# EAGLE design HackHarder (EAGLE 7.5.0)
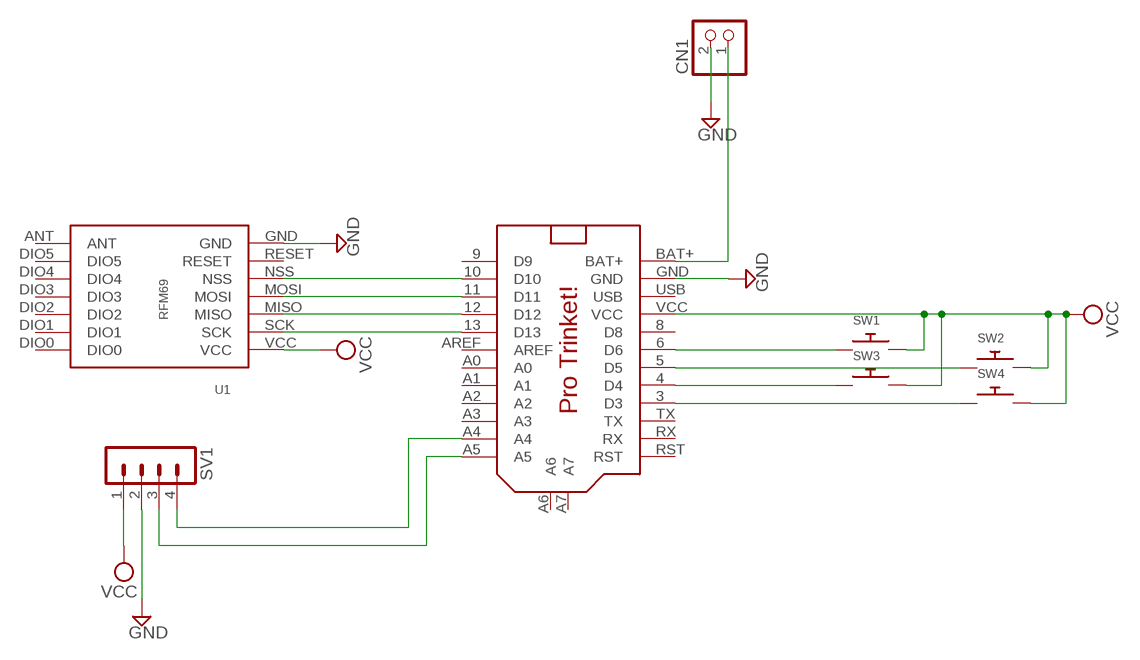
[diagram p0: schematic, sheet 1]

## Parts
CN1  JST_2PIN-SMT-RA  [JST-PH-2-SMT-RA]
MCU1  PRO_TRINKET  [PROTRINKET]
SV1  MA04-1  [MA04-1]
SW1  SWITCH_PUSHBUTTONEVQ-PE  [TACT_PANA-EVQ]
SW2  SWITCH_PUSHBUTTONEVQ-PE  [TACT_PANA-EVQ]
SW3  SWITCH_PUSHBUTTONEVQ-PE  [TACT_PANA-EVQ]
SW4  SWITCH_PUSHBUTTONEVQ-PE  [TACT_PANA-EVQ]
U1  RFM69HW  [RFM69_PADS]

## Nets
G$1: CN1.2 MCU1.GND SV1.2 U1.GND ; supply symbol labelled GND
N$2: CN1.1 MCU1.BAT+
N$3: MCU1.A5 SV1.3
N$4: MCU1.A4 SV1.4
N$5: MCU1.11(D11) U1.MOSI
N$6: MCU1.12(D12) U1.MISO
N$7: MCU1.13(D13) U1.SCK
N$8: MCU1.10(D10) U1.NSS
N$12: MCU1.6(D6) SW1.P$1
N$13: MCU1.5(D5) SW2.P$1
N$14: MCU1.4(D4) SW3.P$1
N$15: MCU1.3(D3) SW4.P$1
VCC: MCU1.VCC SV1.1 SW1.P$2 SW2.P$2 SW3.P$2 SW4.P$2 U1.VCC
Unconnected: MCU1.8(D8) MCU1.9(D9) MCU1.A0 MCU1.A1 MCU1.A2 MCU1.A3 MCU1.A6 MCU1.A7 MCU1.AREF MCU1.RST MCU1.RX MCU1.TX U1.ANT U1.DIO0 U1.DIO1 U1.DIO2 U1.DIO3 U1.DIO4 U1.DIO5 U1.RESET

## Power pins joined to a net without a drawn wire
USB: MCU1.USB

## Library data of the parts
CN1 = adafruit:JST_2PIN: JST 2-Pin Connectors of various flavors SMT-RA (S2B-PH-SM4) 4UConnector #17311 SMT (B2B-PH-SM4) THM-RA (S2B-PH) THM (B2B-PH)
MCU1 = adafruit:PRO_TRINKET
SV1 = con-lstb:MA04-1: PIN HEADER; OC_FARNELL: unknown; OC_NEWARK: unknown
SW1-SW4 = adafruit:SWITCH_PUSHBUTTON: Buttons SOFTTOUCHSMD_SJ - Soft touch temporary push button (Super Junk Akihabara) Compatible with SKPMANE010 [Mouser: 688-SKPMAN] C&K_KSS = Digikey: KSS221GLFS
U1 = HopeRF-RFMxx:RFM69HW

## Board
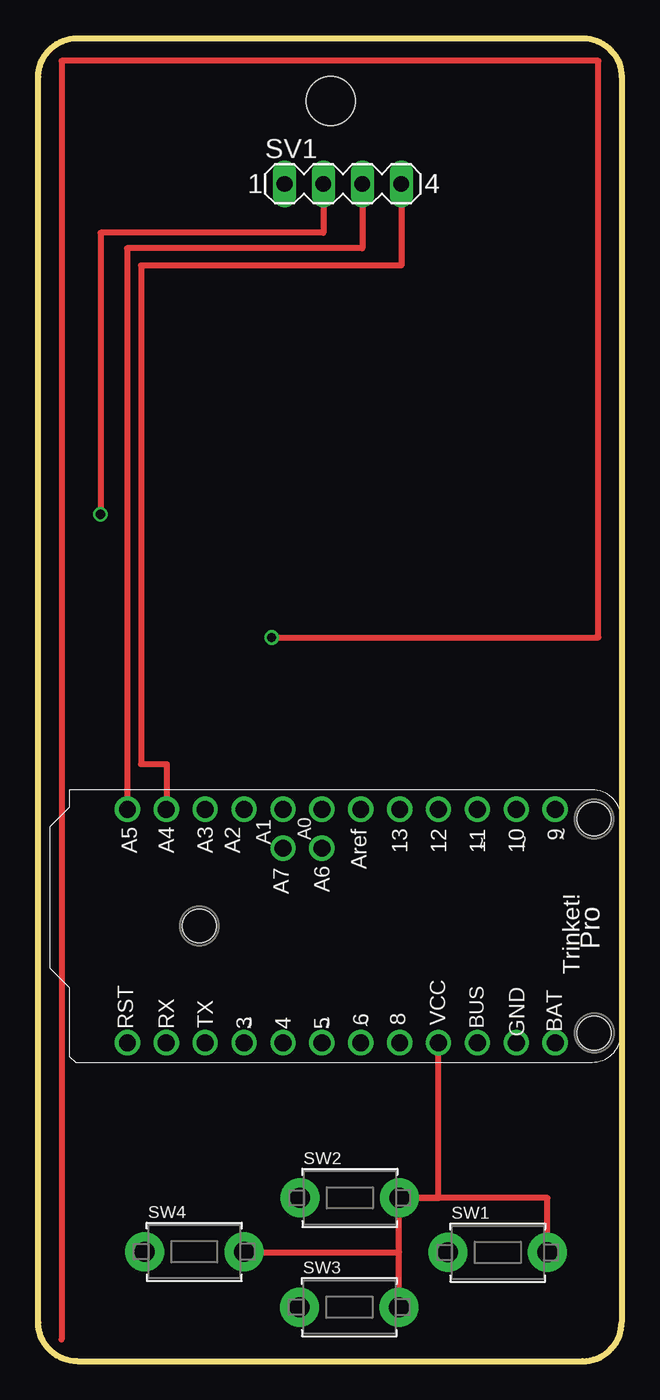
[diagram p1: board, top side]
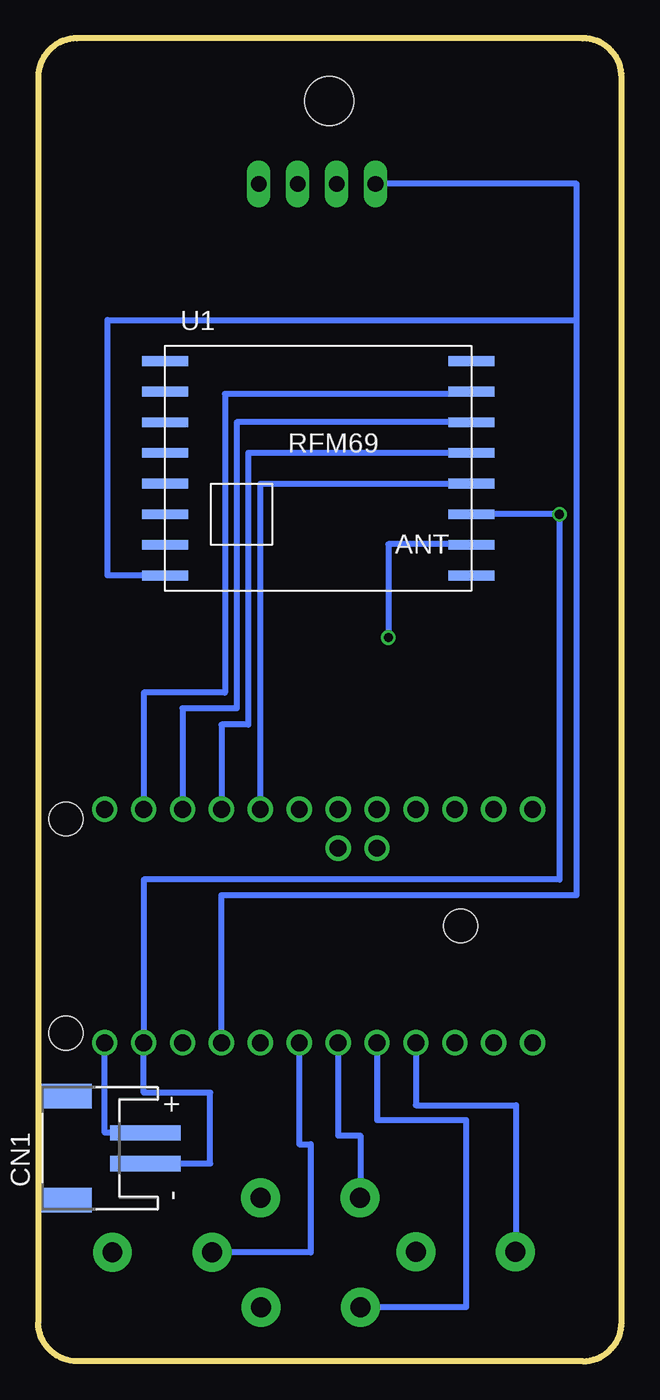
[diagram p2: board, bottom side, seen from below]

Size 38.1 x 86.36 mm. Coordinates in mm from the lower left corner, seen from the top.
Outline: 2.54,86.36 35.56,86.36 arc-90 38.1,83.82 38.1,2.54 arc-90 35.56,0 2.54,0 arc-90 0,2.54 0,83.82 arc-90 2.54,86.36
Copper layers (1*16): Top 0.0356mm / dielectric 1.5011mm / Bottom 0.0356mm
Design rules "oshpark-2layer": minimum track width 6mil, minimum drill 13mil, track to track 6mil, track to pad 6mil, pad to pad 6mil, via to via 6mil, smd to smd 6mil, copper to edge 15mil, drill to drill 6mil, minimum pad ring 7mil, minimum via ring 7mil, stop-mask expansion 2.5mil, vias tented up to drill 0mil, thermal gap 10mil
Holes 3.2 mm at 19.1,82.27

### Footprints (pad centres in the part's own frame; a part is rotated, then mirrored left to right if it is on the bottom)
JST-PH-2-SMT-RA = smd 1 x 4.6: 1 1,-3.7; 2 -1,-3.7 | smd 1.6 x 3.4: NC1 -3.4,1.5; NC2 3.4,1.5
PROTRINKET = drill 1.1: 3 7.62,2.921; 4 7.62,5.461; 5 7.62,8.001; 6 7.62,10.541; 8 7.62,13.081; 9 -7.62,23.241; 10 -7.62,20.701; 11 -7.62,18.161; 12 -7.62,15.621; 13 -7.62,13.081; A0 -7.62,8.001; A1 -7.62,5.461; A2 -7.62,2.921; A3 -7.62,0.381; A4 -7.62,-2.159; A5 -7.62,-4.699; A6 -5.08,8.001; A7 -5.08,5.461; AREF -7.62,10.541; BAT+ 7.62,23.241; GND 7.62,20.701; RST 7.62,-4.699; RX 7.62,-2.159; TX 7.62,0.381; USB 7.62,18.161; VCC 7.62,15.621 | hole 2.2: -6.985,25.781; 6.985,25.781; 0,0
MA04-1 = drill 1.016 long: 1 -3.81,0; 2 -1.27,0; 3 1.27,0; 4 3.81,0
TACT_PANA-EVQ = drill 1.3 pad 2.54: P$1 -3.25,0; P$2 3.25,0
RFM69_PADS = smd 3 x 0.635: ANT 10,-4; DIO0 -10,6; DIO1 -10,4; DIO2 -10,2; DIO3 -10,0; DIO4 -10,-2; DIO5 -10,-4; GND 10,-2; MISO 10,2; MOSI 10,4; NC 10,8; NSS 10,6; P$9 10,-6; RESET -10,8; SCK 10,0; VCC -10,-6

### Placement (x,y rotation side)
CN1  34.82,13.91 90 bottom
MCU1  10.52,28.41 270 top
SV1  19.89,76.86 0 top
SW1  30.01,7.1 0 top
SW2  20.34,10.66 0 top
SW3  20.31,3.53 0 top
SW4  10.19,7.15 0 top
U1  19.82,57.29 0 bottom

### Tracks (layer width: path | path; a pad name or v marks a point on that pad's centre or on a via)
G$1  (via drill 0.6)
  Top 0.406: SV1.2 18.62,73.66 4.06,73.66 v4.06,55.29
  Bottom 0.406: CN1.2 26.87,12.91 26.87,17.53 31.22,17.53 MCU1.GND 31.22,31.45 4.06,31.45 v4.06,55.29 U1.GND
N$2
  Bottom 0.406: CN1.1 33.76,14.91 MCU1.BAT+
N$3
  Top 0.406: SV1.3 21.16,72.64 5.79,72.64 5.79,36.03 MCU1.A5
N$4
  Top 0.406: SV1.4 23.7,71.53 6.71,71.53 6.71,38.98 8.38,38.98 8.38,36.07 MCU1.A4
N$5
  Bottom 0.406: U1.MOSI 25.15,61.29 25.15,42.62 28.68,42.62 MCU1.11
N$6
  Bottom 0.406: U1.MISO 24.38,59.29 24.38,41.55 26.14,41.55 MCU1.12
N$7
  Bottom 0.406: MCU1.13 23.6,57.29 U1.SCK
N$8
  Bottom 0.406: U1.NSS 10.06,63.29 10.06,63.14 25.91,63.14 25.91,43.64 31.22,43.64 MCU1.10
N$11  (via drill 0.6)
  Top 0.406: v15.24,47.24 36.58,47.24 36.58,84.89 1.52,84.89 1.52,1.42
  Bottom 0.406: 9.91,53.34 15.24,53.34 v15.24,47.24
N$12
  Bottom 0.406: MCU1.6 21.06,14.17 20.32,14.17 20.32,7.1 SW1.P$1
N$13
  Bottom 0.406: MCU1.5 18.52,14.73 17.07,14.73 17.07,10.66 SW2.P$1
N$14
  Bottom 0.406: MCU1.4 15.98,15.75 10.16,15.75 10.16,3.53 SW3.P$1
N$15
  Bottom 0.406: MCU1.3 13.44,16.71 6.91,16.71 6.91,7.15 SW4.P$1
VCC
  Top 0.406: SW2.P$2 26.14,10.66 MCU1.VCC | SW1.P$2 33.26,10.66 SW2.P$2 | SW3.P$2 23.56,7.11 | 23.56,7.11 23.56,10.66 SW2.P$2 | SW4.P$2 13.44,7.11 23.56,7.11
  Bottom 0.406: MCU1.VCC 26.14,30.43 2.95,30.43 2.95,67.97 | 2.95,67.97 2.95,76.86 SV1.1 | U1.VCC 33.58,51.29 33.58,67.97 2.95,67.97